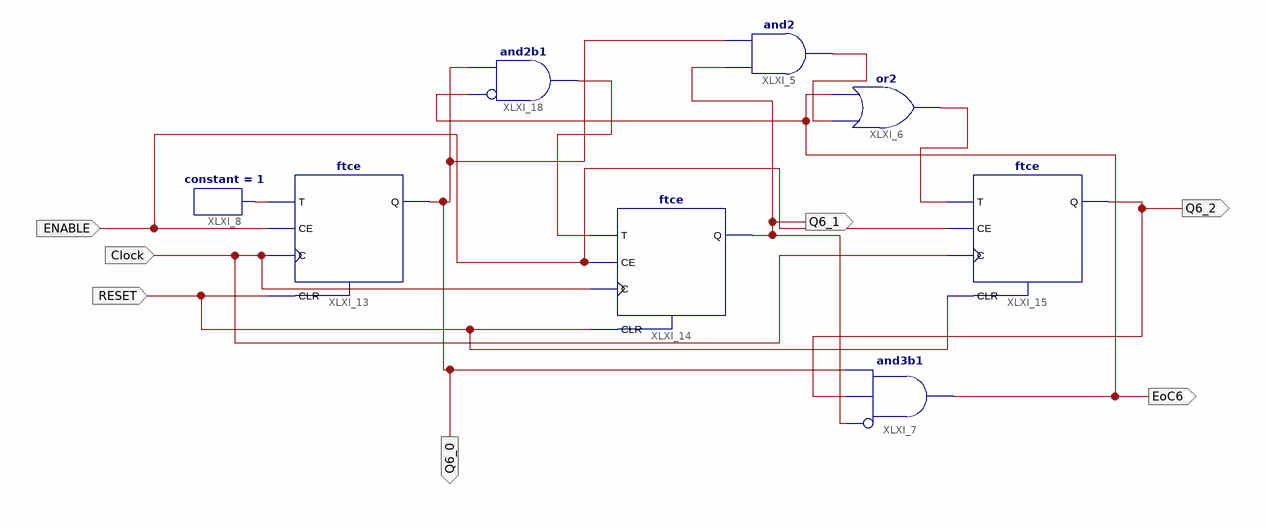
[diagram p0: schematic sheet 1]
// Xilinx ISE schematic Modulo6.sch (spartan6) as structural Verilog: 8 symbols, 7 ports
module Modulo6 (
  input  Clock,
  input  ENABLE,
  input  RESET,
  output Q6_0,
  output Q6_2,
  output EoC6,
  output Q6_1
);

  wire XLXN_8, XLXN_9, XLXN_12, XLXN_13;

  and XLXI_5 (XLXN_8, Q6_1, Q6_0);
  or XLXI_6 (XLXN_9, XLXN_8, EoC6);
  and XLXI_7 (EoC6, ~Q6_1, Q6_2, Q6_0);  // and3b1
  constant #(.CValue("1")) XLXI_8 (.O(XLXN_13));
  ftce XLXI_13 (.C(Clock), .CE(ENABLE), .CLR(RESET), .T(XLXN_13), .Q(Q6_0));
  ftce XLXI_14 (.C(Clock), .CE(ENABLE), .CLR(RESET), .T(XLXN_12), .Q(Q6_1));
  ftce XLXI_15 (.C(Clock), .CE(ENABLE), .CLR(RESET), .T(XLXN_9), .Q(Q6_2));
  and XLXI_18 (XLXN_12, ~EoC6, Q6_0);  // and2b1
endmodule
